# EasyEDA Pro project Source_r00fu_Synth .epro, schematic Schematic1
Board Name: Board1; Create Date: 2026-06-15; Page Name: P1; Project Name: kaamil_synth; Schematic Name: Schematic1; Update Date: 2026-06-17; Company: EasyEDA.com; Page Size: A4; Version: V1.0
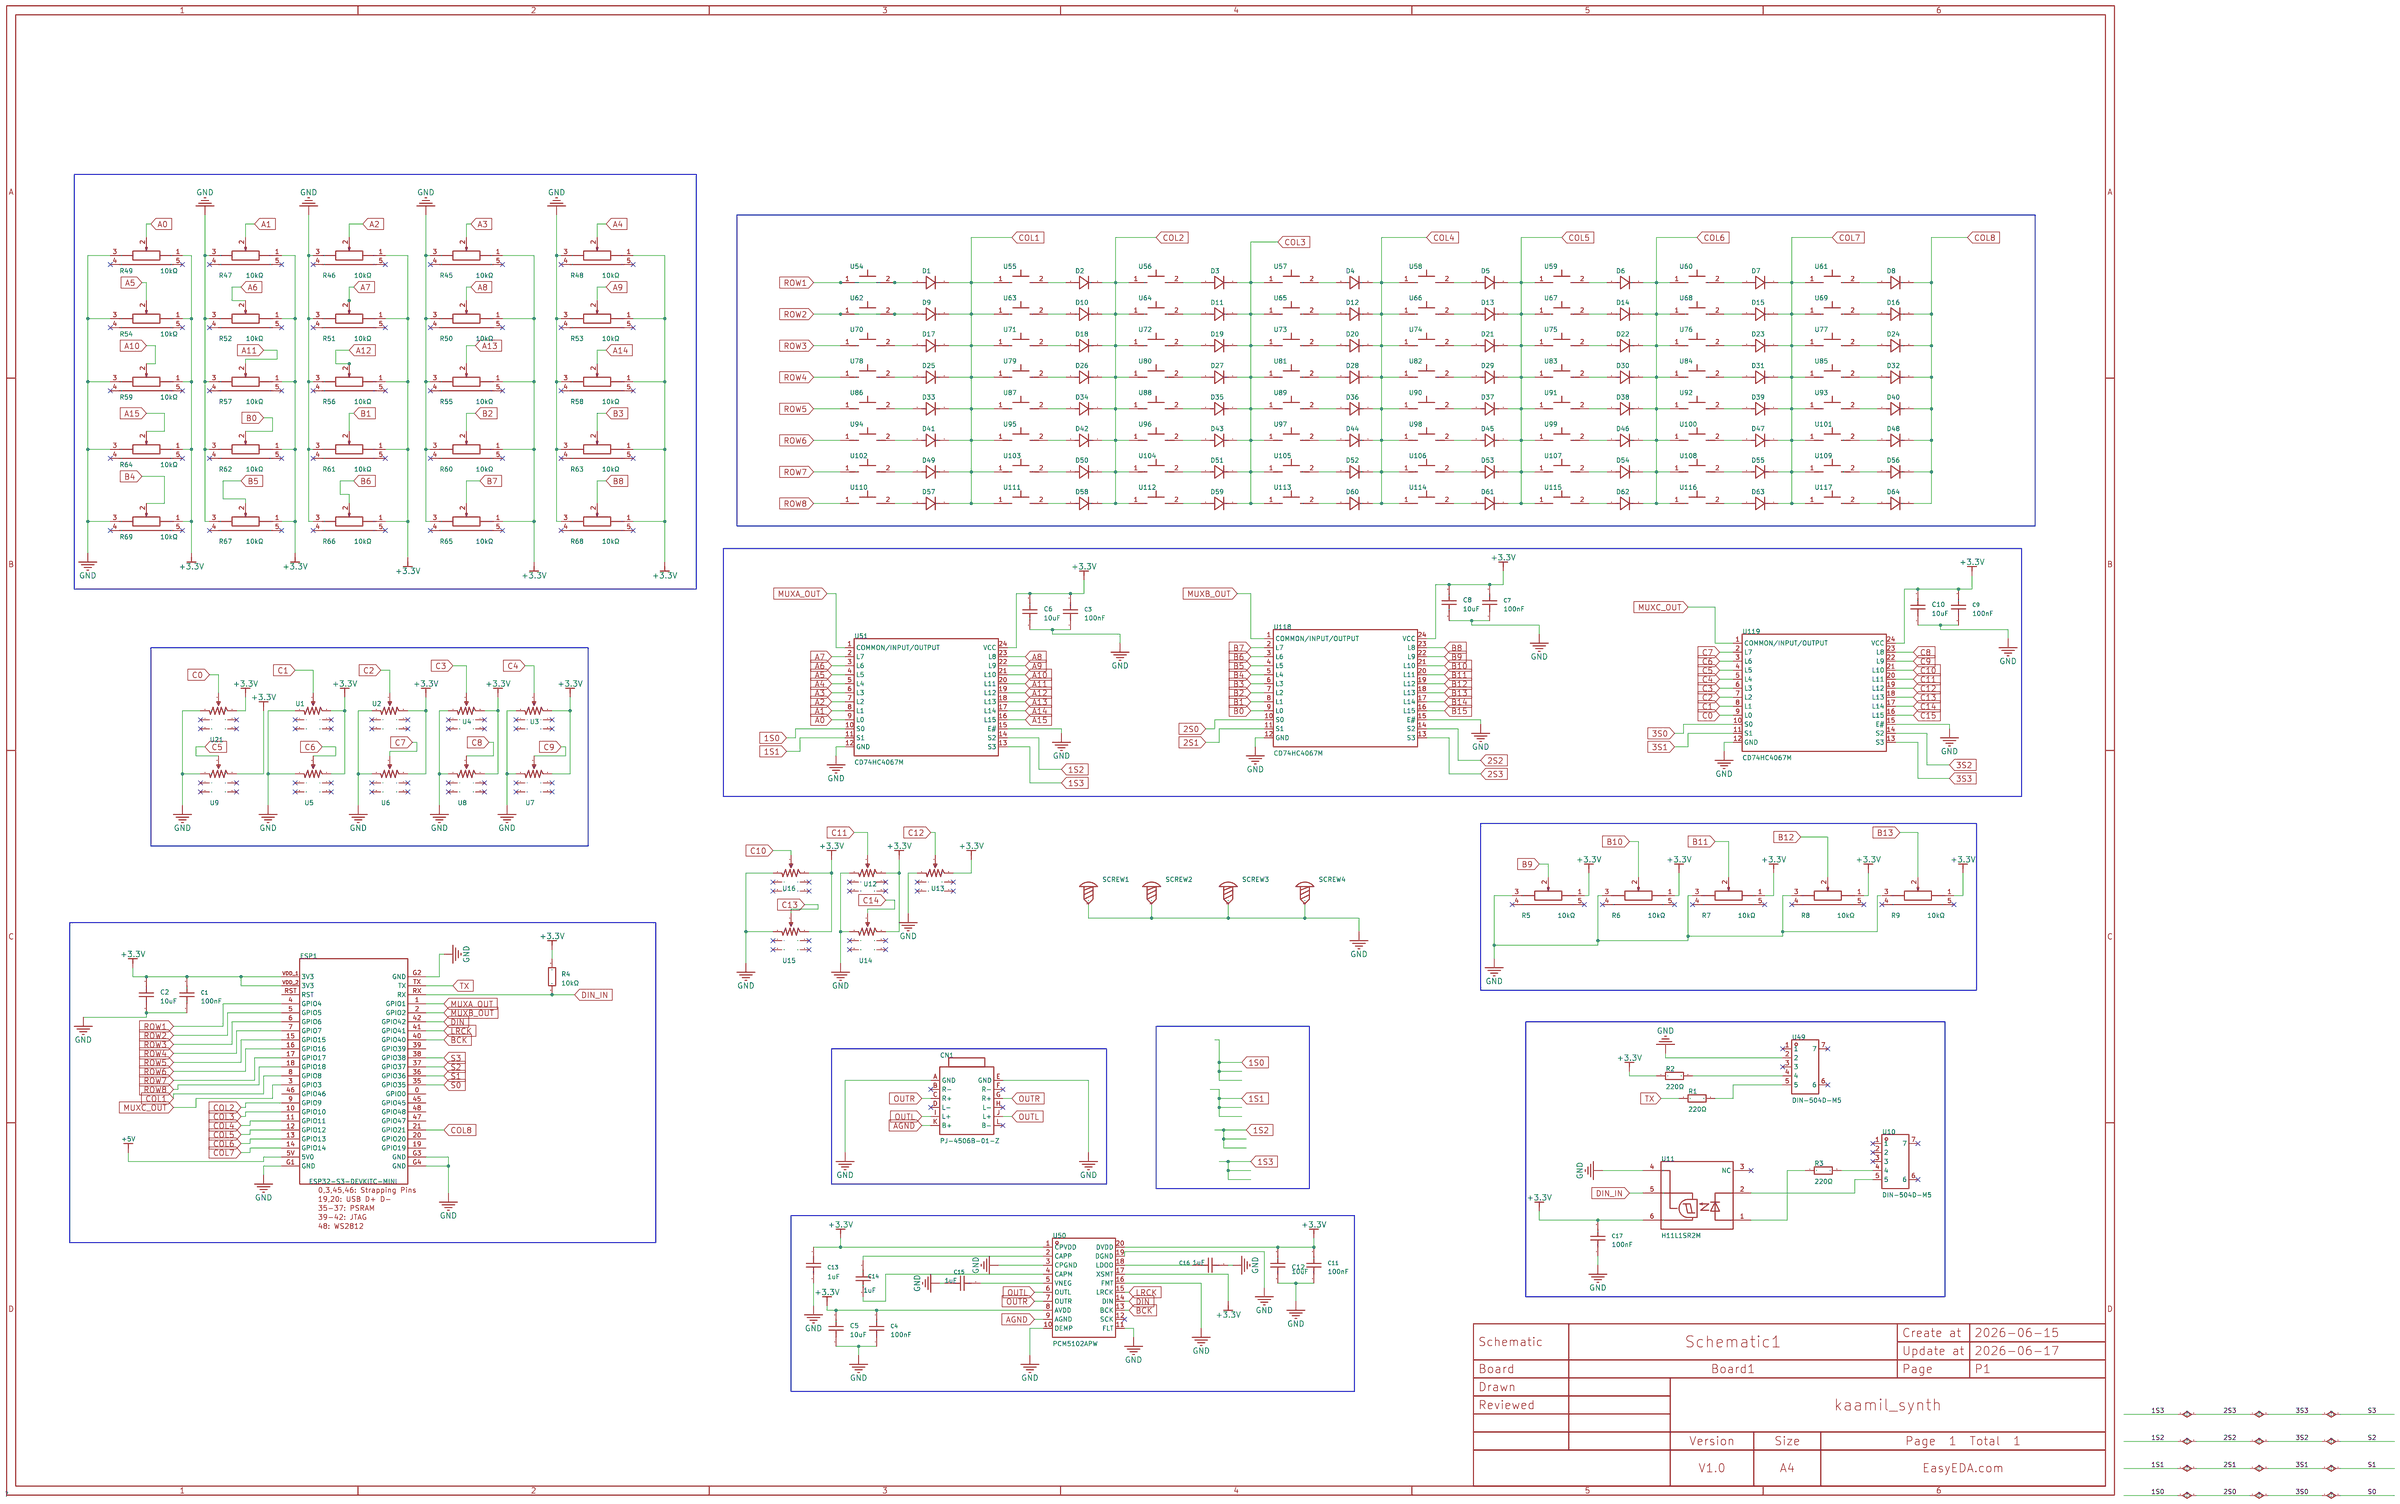
[diagram p0: schematic sheet]

## Parts
C1  100nF  [C0402]
C2  10uF  [C0402]
C3  100nF  [C0402]
C4  100nF  [C0402]
C5  10uF  [C0402]
C6  10uF  [C0402]
C7  100nF  [C0402]
C8  10uF  [C0402]
C9  100nF  [C0402]
C10  10uF  [C0402]
C11  100nF  [C0402]
C12  10uF  [C0402]
C13  1uF  [C0603]
C14  1uF  [C0603]
C15  1uF  [C0603]
C16  1uF  [C0603]
C17  100nF  [C0402]
CN1  PJ-4506B-01-Z  [AUDIO-TH_PJ-4506B-01-Z]
D1  1N4148W  [SOD-123_L2.8-W1.8-LS3.7-RD-1]
D2  1N4148W  [SOD-123_L2.8-W1.8-LS3.7-RD-1]
D3  1N4148W  [SOD-123_L2.8-W1.8-LS3.7-RD-1]
D4  1N4148W  [SOD-123_L2.8-W1.8-LS3.7-RD-1]
D5  1N4148W  [SOD-123_L2.8-W1.8-LS3.7-RD-1]
D6  1N4148W  [SOD-123_L2.8-W1.8-LS3.7-RD-1]
D7  1N4148W  [SOD-123_L2.8-W1.8-LS3.7-RD-1]
D8  1N4148W  [SOD-123_L2.8-W1.8-LS3.7-RD-1]
D9  1N4148W  [SOD-123_L2.8-W1.8-LS3.7-RD-1]
D10  1N4148W  [SOD-123_L2.8-W1.8-LS3.7-RD-1]
D11  1N4148W  [SOD-123_L2.8-W1.8-LS3.7-RD-1]
D12  1N4148W  [SOD-123_L2.8-W1.8-LS3.7-RD-1]
D13  1N4148W  [SOD-123_L2.8-W1.8-LS3.7-RD-1]
D14  1N4148W  [SOD-123_L2.8-W1.8-LS3.7-RD-1]
D15  1N4148W  [SOD-123_L2.8-W1.8-LS3.7-RD-1]
D16  1N4148W  [SOD-123_L2.8-W1.8-LS3.7-RD-1]
D17  1N4148W  [SOD-123_L2.8-W1.8-LS3.7-RD-1]
D18  1N4148W  [SOD-123_L2.8-W1.8-LS3.7-RD-1]
D19  1N4148W  [SOD-123_L2.8-W1.8-LS3.7-RD-1]
D20  1N4148W  [SOD-123_L2.8-W1.8-LS3.7-RD-1]
D21  1N4148W  [SOD-123_L2.8-W1.8-LS3.7-RD-1]
D22  1N4148W  [SOD-123_L2.8-W1.8-LS3.7-RD-1]
D23  1N4148W  [SOD-123_L2.8-W1.8-LS3.7-RD-1]
D24  1N4148W  [SOD-123_L2.8-W1.8-LS3.7-RD-1]
D25  1N4148W  [SOD-123_L2.8-W1.8-LS3.7-RD-1]
D26  1N4148W  [SOD-123_L2.8-W1.8-LS3.7-RD-1]
D27  1N4148W  [SOD-123_L2.8-W1.8-LS3.7-RD-1]
D28  1N4148W  [SOD-123_L2.8-W1.8-LS3.7-RD-1]
D29  1N4148W  [SOD-123_L2.8-W1.8-LS3.7-RD-1]
D30  1N4148W  [SOD-123_L2.8-W1.8-LS3.7-RD-1]
D31  1N4148W  [SOD-123_L2.8-W1.8-LS3.7-RD-1]
D32  1N4148W  [SOD-123_L2.8-W1.8-LS3.7-RD-1]
D33  1N4148W  [SOD-123_L2.8-W1.8-LS3.7-RD-1]
D34  1N4148W  [SOD-123_L2.8-W1.8-LS3.7-RD-1]
D35  1N4148W  [SOD-123_L2.8-W1.8-LS3.7-RD-1]
D36  1N4148W  [SOD-123_L2.8-W1.8-LS3.7-RD-1]
D37  1N4148W  [SOD-123_L2.8-W1.8-LS3.7-RD-1]
D38  1N4148W  [SOD-123_L2.8-W1.8-LS3.7-RD-1]
D39  1N4148W  [SOD-123_L2.8-W1.8-LS3.7-RD-1]
D40  1N4148W  [SOD-123_L2.8-W1.8-LS3.7-RD-1]
D41  1N4148W  [SOD-123_L2.8-W1.8-LS3.7-RD-1]
D42  1N4148W  [SOD-123_L2.8-W1.8-LS3.7-RD-1]
D43  1N4148W  [SOD-123_L2.8-W1.8-LS3.7-RD-1]
D44  1N4148W  [SOD-123_L2.8-W1.8-LS3.7-RD-1]
D45  1N4148W  [SOD-123_L2.8-W1.8-LS3.7-RD-1]
D46  1N4148W  [SOD-123_L2.8-W1.8-LS3.7-RD-1]
D47  1N4148W  [SOD-123_L2.8-W1.8-LS3.7-RD-1]
D48  1N4148W  [SOD-123_L2.8-W1.8-LS3.7-RD-1]
D49  1N4148W  [SOD-123_L2.8-W1.8-LS3.7-RD-1]
D50  1N4148W  [SOD-123_L2.8-W1.8-LS3.7-RD-1]
D51  1N4148W  [SOD-123_L2.8-W1.8-LS3.7-RD-1]
D52  1N4148W  [SOD-123_L2.8-W1.8-LS3.7-RD-1]
D53  1N4148W  [SOD-123_L2.8-W1.8-LS3.7-RD-1]
D54  1N4148W  [SOD-123_L2.8-W1.8-LS3.7-RD-1]
D55  1N4148W  [SOD-123_L2.8-W1.8-LS3.7-RD-1]
D56  1N4148W  [SOD-123_L2.8-W1.8-LS3.7-RD-1]
D57  1N4148W  [SOD-123_L2.8-W1.8-LS3.7-RD-1]
D58  1N4148W  [SOD-123_L2.8-W1.8-LS3.7-RD-1]
D59  1N4148W  [SOD-123_L2.8-W1.8-LS3.7-RD-1]
D60  1N4148W  [SOD-123_L2.8-W1.8-LS3.7-RD-1]
D61  1N4148W  [SOD-123_L2.8-W1.8-LS3.7-RD-1]
D62  1N4148W  [SOD-123_L2.8-W1.8-LS3.7-RD-1]
D63  1N4148W  [SOD-123_L2.8-W1.8-LS3.7-RD-1]
D64  1N4148W  [SOD-123_L2.8-W1.8-LS3.7-RD-1]
ESP1  ESP32-S3-DEVKITC-MINI  [ESP32S3-DEVKIT-C1-V10]
R1  220Ω  [R0603]
R2  220Ω  [R0603]
R3  220Ω  [R0603]
R4  10kΩ  [R0603]
R5  10kΩ  [RES-ADJ-TH_RK09K1130A5R]
R6  10kΩ  [RES-ADJ-TH_RK09K1130A5R]
R7  10kΩ  [RES-ADJ-TH_RK09K1130A5R]
R8  10kΩ  [RES-ADJ-TH_RK09K1130A5R]
R9  10kΩ  [RES-ADJ-TH_RK09K1130A5R]
R45  10kΩ  [RES-ADJ-TH_RK09K1130A5R]
R46  10kΩ  [RES-ADJ-TH_RK09K1130A5R]
R47  10kΩ  [RES-ADJ-TH_RK09K1130A5R]
R48  10kΩ  [RES-ADJ-TH_RK09K1130A5R]
R49  10kΩ  [RES-ADJ-TH_RK09K1130A5R]
R50  10kΩ  [RES-ADJ-TH_RK09K1130A5R]
R51  10kΩ  [RES-ADJ-TH_RK09K1130A5R]
R52  10kΩ  [RES-ADJ-TH_RK09K1130A5R]
R53  10kΩ  [RES-ADJ-TH_RK09K1130A5R]
R54  10kΩ  [RES-ADJ-TH_RK09K1130A5R]
R55  10kΩ  [RES-ADJ-TH_RK09K1130A5R]
R56  10kΩ  [RES-ADJ-TH_RK09K1130A5R]
R57  10kΩ  [RES-ADJ-TH_RK09K1130A5R]
R58  10kΩ  [RES-ADJ-TH_RK09K1130A5R]
R59  10kΩ  [RES-ADJ-TH_RK09K1130A5R]
R60  10kΩ  [RES-ADJ-TH_RK09K1130A5R]
R61  10kΩ  [RES-ADJ-TH_RK09K1130A5R]
R62  10kΩ  [RES-ADJ-TH_RK09K1130A5R]
R63  10kΩ  [RES-ADJ-TH_RK09K1130A5R]
R64  10kΩ  [RES-ADJ-TH_RK09K1130A5R]
R65  10kΩ  [RES-ADJ-TH_RK09K1130A5R]
R66  10kΩ  [RES-ADJ-TH_RK09K1130A5R]
R67  10kΩ  [RES-ADJ-TH_RK09K1130A5R]
R68  10kΩ  [RES-ADJ-TH_RK09K1130A5R]
R69  10kΩ  [RES-ADJ-TH_RK09K1130A5R]
SCREW1  -  [Screw-Hole-M4]
SCREW2  -  [Screw-Hole-M4]
SCREW3  -  [Screw-Hole-M4]
SCREW4  -  [Screw-Hole-M4]
U1  PTA3043-2010CIB103  [RES-ADJ-TH_PTA3043]
U2  PTA3043-2010CIB103  [RES-ADJ-TH_PTA3043]
U3  PTA3043-2010CIB103  [RES-ADJ-TH_PTA3043]
U4  PTA3043-2010CIB103  [RES-ADJ-TH_PTA3043]
U5  PTA3043-2010CIB103  [RES-ADJ-TH_PTA3043]
U6  PTA3043-2010CIB103  [RES-ADJ-TH_PTA3043]
U7  PTA3043-2010CIB103  [RES-ADJ-TH_PTA3043]
U8  PTA3043-2010CIB103  [RES-ADJ-TH_PTA3043]
U9  PTA3043-2010CIB103  [RES-ADJ-TH_PTA3043]
U10  DIN-504D-M5  [CONN-TH_DIN-504D-M5]
U11  H11L1SR2M  [SMD-6_L8.7-W6.5-P2.54-LS10.6-BL]
U12  PTA3043-2010CIB103  [RES-ADJ-TH_PTA3043]
U13  PTA3043-2010CIB103  [RES-ADJ-TH_PTA3043]
U14  PTA3043-2010CIB103  [RES-ADJ-TH_PTA3043]
U15  PTA3043-2010CIB103  [RES-ADJ-TH_PTA3043]
U16  PTA3043-2010CIB103  [RES-ADJ-TH_PTA3043]
U21  PTA3043-2010CIB103  [RES-ADJ-TH_PTA3043]
U49  DIN-504D-M5  [CONN-TH_DIN-504D-M5]
U50  PCM5102APW  [TSSOP-20_L6.5-W4.4-P0.65-LS6.4-BL]
U51  CD74HC4067M  [SOIC-24_L15.4-W7.5-P1.27-LS10.3-BL]
U54  CPG151101D01  [SW-TH_CPG151101D9X]
U55  CPG151101D01  [SW-TH_CPG151101D9X]
U56  CPG151101D01  [SW-TH_CPG151101D9X]
U57  CPG151101D01  [SW-TH_CPG151101D9X]
U58  CPG151101D01  [SW-TH_CPG151101D9X]
U59  CPG151101D01  [SW-TH_CPG151101D9X]
U60  CPG151101D01  [SW-TH_CPG151101D9X]
U61  CPG151101D01  [SW-TH_CPG151101D9X]
U62  CPG151101D01  [SW-TH_CPG151101D9X]
U63  CPG151101D01  [SW-TH_CPG151101D9X]
U64  CPG151101D01  [SW-TH_CPG151101D9X]
U65  CPG151101D01  [SW-TH_CPG151101D9X]
U66  CPG151101D01  [SW-TH_CPG151101D9X]
U67  CPG151101D01  [SW-TH_CPG151101D9X]
U68  CPG151101D01  [SW-TH_CPG151101D9X]
U69  CPG151101D01  [SW-TH_CPG151101D9X]
U70  CPG151101D01  [SW-TH_CPG151101D9X]
U71  CPG151101D01  [SW-TH_CPG151101D9X]
U72  CPG151101D01  [SW-TH_CPG151101D9X]
U73  CPG151101D01  [SW-TH_CPG151101D9X]
U74  CPG151101D01  [SW-TH_CPG151101D9X]
U75  CPG151101D01  [SW-TH_CPG151101D9X]
U76  CPG151101D01  [SW-TH_CPG151101D9X]
U77  CPG151101D01  [SW-TH_CPG151101D9X]
U78  CPG151101D01  [SW-TH_CPG151101D9X]
U79  CPG151101D01  [SW-TH_CPG151101D9X]
U80  CPG151101D01  [SW-TH_CPG151101D9X]
U81  CPG151101D01  [SW-TH_CPG151101D9X]
U82  CPG151101D01  [SW-TH_CPG151101D9X]
U83  CPG151101D01  [SW-TH_CPG151101D9X]
U84  CPG151101D01  [SW-TH_CPG151101D9X]
U85  CPG151101D01  [SW-TH_CPG151101D9X]
U86  CPG151101D01  [SW-TH_CPG151101D9X]
U87  CPG151101D01  [SW-TH_CPG151101D9X]
U88  CPG151101D01  [SW-TH_CPG151101D9X]
U89  CPG151101D01  [SW-TH_CPG151101D9X]
U90  CPG151101D01  [SW-TH_CPG151101D9X]
U91  CPG151101D01  [SW-TH_CPG151101D9X]
U92  CPG151101D01  [SW-TH_CPG151101D9X]
U93  CPG151101D01  [SW-TH_CPG151101D9X]
U94  CPG151101D01  [SW-TH_CPG151101D9X]
U95  CPG151101D01  [SW-TH_CPG151101D9X]
U96  CPG151101D01  [SW-TH_CPG151101D9X]
U97  CPG151101D01  [SW-TH_CPG151101D9X]
U98  CPG151101D01  [SW-TH_CPG151101D9X]
U99  CPG151101D01  [SW-TH_CPG151101D9X]
U100  CPG151101D01  [SW-TH_CPG151101D9X]
U101  CPG151101D01  [SW-TH_CPG151101D9X]
U102  CPG151101D01  [SW-TH_CPG151101D9X]
U103  CPG151101D01  [SW-TH_CPG151101D9X]
U104  CPG151101D01  [SW-TH_CPG151101D9X]
U105  CPG151101D01  [SW-TH_CPG151101D9X]
U106  CPG151101D01  [SW-TH_CPG151101D9X]
U107  CPG151101D01  [SW-TH_CPG151101D9X]
U108  CPG151101D01  [SW-TH_CPG151101D9X]
U109  CPG151101D01  [SW-TH_CPG151101D9X]
U110  CPG151101D01  [SW-TH_CPG151101D9X]
U111  CPG151101D01  [SW-TH_CPG151101D9X]
U112  CPG151101D01  [SW-TH_CPG151101D9X]
U113  CPG151101D01  [SW-TH_CPG151101D9X]
U114  CPG151101D01  [SW-TH_CPG151101D9X]
U115  CPG151101D01  [SW-TH_CPG151101D9X]
U116  CPG151101D01  [SW-TH_CPG151101D9X]
U117  CPG151101D01  [SW-TH_CPG151101D9X]
U118  CD74HC4067M  [SOIC-24_L15.4-W7.5-P1.27-LS10.3-BL]
U119  CD74HC4067M  [SOIC-24_L15.4-W7.5-P1.27-LS10.3-BL]

## Library data of the parts
C1 C3 C4 C7 C9 C11 C17 = AC0402KRX7R9BB104: Capacitance:100nF Tolerance:±10% Tolerance:±10% Voltage Rating:50V Temperature Coefficient:X7R; LCSC Part Name: 100nF ±10% 50V; Supplier Part: C2888326; Manufacturer: YAGEO(国巨); Supplier Footprint: 0402; JLCPCB Part Class: Extended Part; Datasheet: https://item.szlcsc.com/datasheet/AC0402KRX7R9BB104/3108046.html; Supplier: LCSC; Tolerance: ±10%; Voltage Rating: 50V; Temperature Coefficient: X7R
C2 C5 C6 C8 C10 C12 = CL05A106MP8NUB8: Capacitance:10uF Tolerance:±20% Tolerance:±20% Voltage Rating:10V Temperature Coefficient:X5R; LCSC Part Name: 10uF ±20% 10V; Supplier Part: C307415; Manufacturer: SAMSUNG(三星); Supplier Footprint: 0402; JLCPCB Part Class: Extended Part; Datasheet: https://item.szlcsc.com/datasheet/CL05A106MP8NUB8/291089.html; Supplier: LCSC; Tolerance: ±20%; Voltage Rating: 10V; Temperature Coefficient: X5R
C13-C16 = CC0603JRX7R7BB105: Capacitance: Tolerance:±5% Tolerance:±5% Voltage Rated: Temperature Coefficient:; LCSC Part Name: 1uF ±5% 16V; Supplier Part: C519560; Manufacturer: YAGEO(国巨); Supplier Footprint: 0603; JLCPCB Part Class: Extended Part; Datasheet: https://atta.szlcsc.com/upload/public/pdf/source/20200423/C519560_04055A817EC1D690632F33783E937415.pdf; Supplier: LCSC; Tolerance: ±5%
CN1 = PJ-4506B-01-Z: Connector Type:3.5mm Headphone Jack Current Rating:1A Voltage Rating (Max):12V Contact Material:Brass Contact Plating:Gold Operating Temperature:-25℃~+85℃ Operating Temperature:-25℃~+85℃; LCSC Part Name: 3.5mm耳机座; Supplier Part: C41347691; Manufacturer: HOOYA(皓宇电子); Supplier Footprint: 插件; Datasheet: https://item.szlcsc.com/datasheet/PJ-4506B-01-Z/43075737.html; Supplier: LCSC; Connector Type: 3.5mm Headphone Jack; Current Rating: 1A; Voltage Rating (Max): 12V; Contact Material: Brass; Contact Plating: Gold; Operating Temperature: -25℃~+85℃
D1-D64 = 1N4148W_C917030: Diode Configuration:Independent Voltage - Forward(Vf@If):1.25V@150mA Voltage - DC Reverse(Vr):100V Current - Rectified:300mA Pd - Power Dissipation:400mW Reverse Leakage Current (Ir):1uA@75V Reverse Recovery Time (trr):8ns Operating Junction Temperature R; Supplier Part: C917030; Manufacturer: JSMSEMI(杰盛微); Supplier Footprint: SOD-123; JLCPCB Part Class: Extended Part; Datasheet: https://item.szlcsc.com/datasheet/1N4148W/991526.html; Supplier: LCSC; Diode Configuration: Independent; Voltage - Forward(Vf@If): 1.25V@150mA; Voltage - DC Reverse(Vr): 100V; Current - Rectified: 300mA; Pd - Power Dissipation: 400mW; Reverse Leakage Current (Ir): 1uA@75V; Reverse Recovery Time (trr): 8ns; Operating Junction Temperature Range: -55℃~+150℃@(Tj); Non-Repetitive Peak Forward Surge Current: 4A
ESP1 = ESP32-S3-DEVKITC-MINI: Check: false
R1-R3 = RC0603JR-07220RL: Type:Thick Film Resistors Resistance: Tolerance:±5% Tolerance:±5% Power(Watts): Overload Voltage (Max): Temperature Coefficient:±100ppm/℃ Temperature Coefficient:±100ppm/℃ Operating Temperature Range:-55℃~+155℃ Operating Temperature Range:-55℃~+155℃; LCSC Part Name: 厚膜电阻 220Ω ±5% 100mW; Supplier Part: C114683; Manufacturer: YAGEO(国巨); Supplier Footprint: 0603; JLCPCB Part Class: Extended Part; Datasheet: https://atta.szlcsc.com/upload/public/pdf/source/20180821/C275644_0D56F95EFF785E7D9A1FEF436B37DA78.pdf; Supplier: LCSC; Type: Thick Film Resistors; Tolerance: ±5%; Temperature Coefficient: ±100ppm/℃; Operating Temperature Range: -55℃~+155℃
R4 = RT0603BRD0710KL: Type:Thin Film Resistor Resistance:10kΩ Tolerance:±0.1% Tolerance:±0.1% Power(Watts):100mW Voltage-Supply(Max):75V Temperature Coefficient:±25ppm/℃ Temperature Coefficient:±25ppm/℃ Operating Temperature:-55℃~+155℃ Operating Temperature:-55℃~+155℃; LCSC Part Name: 薄膜电阻 10kΩ ±0.1% 100mW; Supplier Part: C95204; Manufacturer: YAGEO(国巨); Supplier Footprint: 0603; JLCPCB Part Class: Extended Part; Datasheet: https://item.szlcsc.com/datasheet/RT0603BRD0710KL/96405.html; Supplier: LCSC; Type: Thin Film Resistor; Tolerance: ±0.1%; Power(Watts): 100mW; Voltage-Supply(Max): 75V; Temperature Coefficient: ±25ppm/℃; Operating Temperature: -55℃~+155℃
R5-R9 R45-R69 = RK09K1130A5R: Resistance:10kΩ Tolerance:±20% Tolerance:±20% Voltage Rating:20V Power(Watts):50mW; LCSC Part Name: 10kΩ ±20%; Supplier Part: C209779; Manufacturer: ALPSALPINE(阿尔卑斯阿尔派); Supplier Footprint: 插件; JLCPCB Part Class: Extended Part; Datasheet: https://item.szlcsc.com/datasheet/RK09K1130A5R/210748.html; Supplier: LCSC; Tolerance: ±20%; Voltage Rating: 20V; Power(Watts): 50mW
SCREW1-SCREW4 = Screw-Hole-M4: Supplier Footprint: 插件; Check: false
U1-U9 U12-U16 U21 = PTA3043-2010CIB103: Supplier Part: C5357832; Manufacturer: BOURNS; JLCPCB Part Class: Extended Part; Datasheet: https://item.szlcsc.com/datasheet/PTA3043-2010CIB103/6166468.html; Supplier: LCSC
U10 U49 = DIN-504D-M5: Supplier Part: C2939347; Manufacturer: HOOYA(皓宇电子); Supplier Footprint: 插件; JLCPCB Part Class: Extended Part; Datasheet: https://atta.szlcsc.com/upload/public/pdf/source/20220120/532EF17F4E31596A224288A7E1F8E76D.pdf; Supplier: LCSC
U11 = H11L1SR2M: Input Type:DC Supply Voltage:3V~15V Supply Voltage:3V~15V Isolation Voltage(rms):4.17kV Common Mode Transient Immunity (CMTI):- Number of Channels:1 Operating Temperature:-40℃~+85℃ Operating Temperature:-40℃~+85℃; LCSC Part Name: DC输入 1通道 隔离电压(rms):4170V; Supplier Part: C20082; Manufacturer: onsemi(安森美); Supplier Footprint: SOP-6-2.54mm; JLCPCB Part Class: Extended Part; Datasheet: https://atta.szlcsc.com/upload/public/pdf/source/20170508/1494211009819.pdf; Supplier: LCSC; Input Type: DC; Supply Voltage: 3V~15V; Isolation Voltage(rms): 4.17kV; Number of Channels: 1; Operating Temperature: -40℃~+85℃
U50 = PCM5102APW: Resolution (Bits):32 Number of Channels:2 Voltage - Supply:1.8V~3.6V Voltage - Supply:1.8V~3.6V Interface Type:I2S The Chip Type:- Operating Temperature:-25℃~+85℃ Operating Temperature:-25℃~+85℃ Voltage Reference:- Voltage Reference Value:- Voltage Refere; LCSC Part Name: PCM5102A, PCM5101A, PCM5100A 2.1VRMS 112/106/100dB 音频立体声DAC; Supplier Part: C1520792; Manufacturer: TI(德州仪器); Supplier Footprint: TSSOP-20; JLCPCB Part Class: Extended Part; Datasheet: https://www.ti.com/cn/lit/gpn/pcm5102a; Supplier: LCSC; Resolution (Bits): 32; Number of Channels: 2; Voltage - Supply: 1.8V~3.6V; Interface Type: I2S; Operating Temperature: -25℃~+85℃
U51 U118 U119 = CD74HC4067M: Switch Circuit:16:1 Number of Channels:16 Ron:160Ω Voltage - Supply:2V~6V Voltage - Supply:2V~6V Con:- Turn-on time:345ns Turn-off time:365ns Bandwidth:89MHz Operating Temperature:-55℃~+125℃ Operating Temperature:-55℃~+125℃ Propagation Delay (tpd):22ns Fe; LCSC Part Name: 高速CMOS逻辑 16通道模拟多路复用器/解复用器; Supplier Part: C1545936; Manufacturer: TI(德州仪器); Supplier Footprint: SOIC-24-300mil; JLCPCB Part Class: Extended Part; Datasheet: https://www.ti.com/cn/lit/gpn/cd74hct4067; Supplier: LCSC; Switch Circuit: 16:1; Number of Channels: 16; Ron: 160Ω; Voltage - Supply: 2V~6V; Turn-on time: 345ns; Turn-off time: 365ns; Bandwidth: 89MHz; Operating Temperature: -55℃~+125℃; Propagation Delay (tpd): 22ns; Features: Bidirectional analog channel；Glitch-free switching
U54-U117 = CPG151101D01: Axis Type:Black Switch Operation Force:60gf Conduction Travel:2mm Voltage Rating:12V Operating Temperature:-40℃~+70℃ Operating Temperature:-40℃~+70℃; LCSC Part Name: 黑轴; Supplier Part: C49234238; Manufacturer: HanElectricity(瀚源); Supplier Footprint: 插件; JLCPCB Part Class: Extended Part; Datasheet: https://item.szlcsc.com/datasheet/CPG151101D01/51650380.html; Supplier: LCSC; Axis Type: Black Switch; Operation Force: 60gf; Conduction Travel: 2mm; Voltage Rating: 12V; Operating Temperature: -40℃~+70℃

## Nets
+3.3V: C1.2 C2.2 C3.2 C4.2 C5.2 C6.2 C7.2 C8.2 C9.2 C10.2 C11.2 C12.2 C13.1 C17.2 ESP1.VDD_1(3V3) ESP1.VDD_2(3V3) R2.1 R4.1 R5.1 R6.1 R7.1 R8.1 R9.1 R45.1 R46.1 R47.1 R48.1 R49.1 R50.1 R51.1 R52.1 R53.1 R54.1 R55.1 R56.1 R57.1 R58.1 R59.1 R60.1 R61.1 R62.1 R63.1 R64.1 R65.1 R66.1 R67.1 R68.1 R69.1 U1.3 U2.3 U3.3 U4.3 U5.3 U6.3 U7.3 U8.3 U9.3 U11.6(VCC) U12.3 U13.3 U14.3 U15.3 U16.3 U21.3 U50.1(CPVDD) U50.8(AVDD) U50.17(XSMT) U50.20(DVDD) U51.24(VCC) U118.24(VCC) U119.24(VCC)
+5V: ESP1.5V(5V0)
AGND: CN1.K(B+) U50.9(AGND)
GND: C1.1 C2.1 C3.1 C4.1 C5.1 C6.1 C7.1 C8.1 C9.1 C10.1 C11.1 C12.1 C13.2 C15.2 C16.1 C17.1 CN1.A(GND) CN1.E(GND) ESP1.G1(GND) ESP1.G2(GND) ESP1.G3(GND) ESP1.G4(GND) R5.3 R6.3 R7.3 R8.3 R45.3 R46.3 R47.3 R48.3 R49.3 R50.3 R51.3 R52.3 R53.3 R54.3 R55.3 R56.3 R57.3 R58.3 R59.3 R60.3 R61.3 R62.3 R63.3 R64.3 R65.3 R66.3 R67.3 R68.3 R69.3 SCREW1.1 SCREW2.1 SCREW3.1 SCREW4.1 U1.1 U2.1 U3.1 U4.1 U5.1 U6.1 U7.1 U8.1 U9.1 U11.4(VO) U12.1 U13.1 U14.1 U15.1 U16.1 U21.1 U49.2 U50.3(CPGND) U50.10(DEMP) U50.11(FLT) U50.16(FMT) U50.19(DGND) U51.12(GND) U51.15(E#) U118.12(GND) U118.15(E#) U119.12(GND) U119.15(E#)
1S0: ESP1.35(GPIO35) U51.10(S0) U118.10(S0) U119.10(S0)
1S1: ESP1.36(GPIO36) U51.11(S1) U118.11(S1) U119.11(S1)
1S2: ESP1.37(GPIO37) U51.14(S2) U118.14(S2) U119.14(S2)
1S3: ESP1.38(GPIO38) U51.13(S3) U118.13(S3) U119.13(S3)
A0: R49.2 U51.9(L0)
A1: R47.2 U51.8(L1)
A2: R46.2 U51.7(L2)
A3: R45.2 U51.6(L3)
A4: R48.2 U51.5(L4)
A5: R54.2 U51.4(L5)
A6: R52.2 U51.3(L6)
A7: R51.2 U51.2(L7)
A8: R50.2 U51.23(L8)
A9: R53.2 U51.22(L9)
A10: R59.2 U51.21(L10)
A11: R57.2 U51.20(L11)
A12: R56.2 U51.19(L12)
A13: R55.2 U51.18(L13)
A14: R58.2 U51.17(L14)
A15: R64.2 U51.16(L15)
B0: R62.2 U118.9(L0)
B1: R61.2 U118.8(L1)
B2: R60.2 U118.7(L2)
B3: R63.2 U118.6(L3)
B4: R69.2 U118.5(L4)
B5: R67.2 U118.4(L5)
B6: R66.2 U118.3(L6)
B7: R65.2 U118.2(L7)
B8: R68.2 U118.23(L8)
B9: R5.2 U118.22(L9)
B10: R6.2 U118.21(L10)
B11: R7.2 U118.20(L11)
B12: R8.2 U118.19(L12)
B13: R9.2 U118.18(L13)
B14: U118.17(L14)
B15: U118.16(L15)
BCK: ESP1.40(GPIO40) U50.13(BCK)
C0: U21.2 U119.9(L0)
C1: U1.2 U119.8(L1)
C2: U2.2 U119.7(L2)
C3: U4.2 U119.6(L3)
C4: U3.2 U119.5(L4)
C5: U9.2 U119.4(L5)
C6: U5.2 U119.3(L6)
C7: U6.2 U119.2(L7)
C8: U8.2 U119.23(L8)
C9: U7.2 U119.22(L9)
C10: U16.2 U119.21(L10)
C11: U12.2 U119.20(L11)
C12: U13.2 U119.19(L12)
C13: U15.2 U119.18(L13)
C14: U14.2 U119.17(L14)
C15: U119.16(L15)
COL1: D1.1(C) D9.1(C) D17.1(C) D25.1(C) D33.1(C) D41.1(C) D49.1(C) D57.1(C) ESP1.8(GPIO8) U55.1 U63.1 U71.1 U79.1 U87.1 U95.1 U103.1 U111.1
COL2: D2.1(C) D10.1(C) D18.1(C) D26.1(C) D34.1(C) D42.1(C) D50.1(C) D58.1(C) ESP1.9(GPIO9) U56.1 U64.1 U72.1 U80.1 U88.1 U96.1 U104.1 U112.1
COL3: D3.1(C) D11.1(C) D19.1(C) D27.1(C) D35.1(C) D43.1(C) D51.1(C) D59.1(C) ESP1.10(GPIO10) U57.1 U65.1 U73.1 U81.1 U89.1 U97.1 U105.1 U113.1
COL4: D4.1(C) D12.1(C) D20.1(C) D28.1(C) D36.1(C) D44.1(C) D52.1(C) D60.1(C) ESP1.11(GPIO11) U58.1 U66.1 U74.1 U82.1 U90.1 U98.1 U106.1 U114.1
COL5: D5.1(C) D13.1(C) D21.1(C) D29.1(C) D37.1(C) D45.1(C) D53.1(C) D61.1(C) ESP1.12(GPIO12) U59.1 U67.1 U75.1 U83.1 U91.1 U99.1 U107.1 U115.1
COL6: D6.1(C) D14.1(C) D22.1(C) D30.1(C) D38.1(C) D46.1(C) D54.1(C) D62.1(C) ESP1.13(GPIO13) U60.1 U68.1 U76.1 U84.1 U92.1 U100.1 U108.1 U116.1
COL7: D7.1(C) D15.1(C) D23.1(C) D31.1(C) D39.1(C) D47.1(C) D55.1(C) D63.1(C) ESP1.14(GPIO14) U61.1 U69.1 U77.1 U85.1 U93.1 U101.1 U109.1 U117.1
COL8: D8.1(C) D16.1(C) D24.1(C) D32.1(C) D40.1(C) D48.1(C) D56.1(C) D64.1(C) ESP1.21(GPIO21)
DIN: ESP1.42(GPIO42) U50.14(DIN)
DIN_IN: ESP1.RX R4.2 U11.5(GND)
LRCK: ESP1.41(GPIO41) U50.15(LRCK)
MUXA_OUT: ESP1.1(GPIO1) U51.1(COMMON/INPUT/OUTPUT)
MUXB_OUT: ESP1.2(GPIO2) U118.1(COMMON/INPUT/OUTPUT)
MUXC_OUT: ESP1.3(GPIO3) U119.1(COMMON/INPUT/OUTPUT)
OUTL: CN1.I(L+) CN1.J(L+) U50.6(OUTL)
OUTR: CN1.C(R+) CN1.G(R+) U50.7(OUTR)
ROW1: D1.2(A) ESP1.4(GPIO4) U54.1 U54.2
ROW2: D9.2(A) ESP1.5(GPIO5) U62.1 U62.2
ROW3: ESP1.6(GPIO6) U70.1
ROW4: ESP1.7(GPIO7) U78.1
ROW5: ESP1.15(GPIO15) U86.1
ROW6: ESP1.16(GPIO16) U94.1
ROW7: ESP1.17(GPIO17) U102.1
ROW8: ESP1.18(GPIO18) U110.1
TX: ESP1.TX R1.1
$1N26761: D2.2(A) U55.2
$1N26911: D4.2(A) U57.2
$1N26913: D3.2(A) U56.2
$1N27211: D6.2(A) U59.2
$1N27213: D5.2(A) U58.2
$1N27215: D8.2(A) U61.2
$1N27217: D7.2(A) U60.2
$1N32107: D12.2(A) U65.2
$1N32109: D11.2(A) U64.2
$1N32111: D13.2(A) U66.2
$1N32113: D16.2(A) U69.2
$1N32117: D14.2(A) U67.2
$1N32119: D15.2(A) U68.2
$1N32129: D10.2(A) U63.2
$1N33315: D17.2(A) U70.2
$1N33317: D18.2(A) U71.2
$1N33319: D19.2(A) U72.2
$1N33321: D20.2(A) U73.2
$1N33323: D21.2(A) U74.2
$1N33325: D22.2(A) U75.2
$1N33327: D23.2(A) U76.2
$1N33329: D24.2(A) U77.2
$1N33345: D25.2(A) U78.2
$1N33347: D26.2(A) U79.2
$1N33349: D27.2(A) U80.2
$1N33351: D28.2(A) U81.2
$1N33353: D29.2(A) U82.2
$1N33355: D30.2(A) U83.2
$1N33357: D31.2(A) U84.2
$1N33359: D32.2(A) U85.2
$1N35743: D33.2(A) U86.2
$1N35745: D34.2(A) U87.2
$1N35747: D35.2(A) U88.2
$1N35749: D36.2(A) U89.2
$1N35751: D37.2(A) U90.2
$1N35753: D38.2(A) U91.2
$1N35755: D39.2(A) U92.2
$1N35757: D40.2(A) U93.2
$1N35773: D41.2(A) U94.2
$1N35775: D42.2(A) U95.2
$1N35777: D43.2(A) U96.2
$1N35779: D44.2(A) U97.2
$1N35781: D45.2(A) U98.2
$1N35783: D46.2(A) U99.2
$1N35785: D47.2(A) U100.2
$1N35787: D48.2(A) U101.2
$1N35803: D49.2(A) U102.2
$1N35805: D50.2(A) U103.2
$1N35807: D51.2(A) U104.2
$1N35809: D52.2(A) U105.2
$1N35811: D53.2(A) U106.2
$1N35813: D54.2(A) U107.2
$1N35815: D55.2(A) U108.2
$1N35817: D56.2(A) U109.2
$1N35833: D57.2(A) U110.2
$1N35835: D58.2(A) U111.2
$1N35837: D59.2(A) U112.2
$1N35839: D60.2(A) U113.2
$1N35841: D61.2(A) U114.2
$1N35843: D62.2(A) U115.2
$1N35845: D63.2(A) U116.2
$1N35847: D64.2(A) U117.2
$1N41810: C14.1 U50.2(CAPP)
$1N41812: C15.1 U50.5(VNEG)
$1N41842: C16.2 U50.18(LDOO)
$1N41846: R1.2 U49.5
$1N41847: R2.2 U49.4
$1N41854: R3.2 U10.4
$1N41855: R3.1 U11.1(AN)
$1N41856: U10.5 U11.2(CAT)
$1N41902: C14.2 U50.4(CAPM)

Not connected (* = marked no-connect by the designer): CN1 B(R-)* D(L-)* F(R-)* H(L-)* L(B-)*; ESP1 0(GPIO0) 19(GPIO19) 20(GPIO20) 39(GPIO39) 45(GPIO45) 46(GPIO46) 47(GPIO47) 48(GPIO48) RST; R5 4(EH)* 5(EH)*; R6 4(EH)* 5(EH)*; R7 4(EH)* 5(EH)*; R8 4(EH)* 5(EH)*; R9 3 4(EH)* 5(EH)*; R45 4(EH)* 5(EH)*; R46 4(EH)* 5(EH)*; R47 4(EH)* 5(EH)*; R48 4(EH)* 5(EH)*; R49 4(EH)* 5(EH)*; R50 4(EH)* 5(EH)*; R51 4(EH)* 5(EH)*; R52 4(EH)* 5(EH)*; R53 4(EH)* 5(EH)*; R54 4(EH)* 5(EH)*; R55 4(EH)* 5(EH)*; R56 4(EH)* 5(EH)*; R57 4(EH)* 5(EH)*; R58 4(EH)* 5(EH)*; R59 4(EH)* 5(EH)*; R60 4(EH)* 5(EH)*; R61 4(EH)* 5(EH)*; R62 4(EH)* 5(EH)*; R63 4(EH)* 5(EH)*; R64 4(EH)* 5(EH)*; R65 4(EH)* 5(EH)*; R66 4(EH)* 5(EH)*; R67 4(EH)* 5(EH)*; R68 4(EH)* 5(EH)*; R69 4(EH)* 5(EH)*; U1 4* 5* 6* 7*; U2 4* 5* 6* 7*; U3 4* 5* 6* 7*; U4 4* 5* 6* 7*; U5 4* 5* 6* 7*; U6 4* 5* 6* 7*; U7 4* 5* 6* 7*; U8 4* 5* 6* 7*; U9 4* 5* 6* 7*; U10 1* 2* 3* 6* 7*; U11 3(NC)*; U12 4* 5* 6* 7*; U13 4* 5* 6* 7*; U14 4* 5* 6* 7*; U15 4* 5* 6* 7*; U16 4* 5* 6* 7*; U21 4* 5* 6* 7*; U49 1* 3* 6* 7*; U50 12(SCK)*
